# Altium project HeatSink.PrjPcb
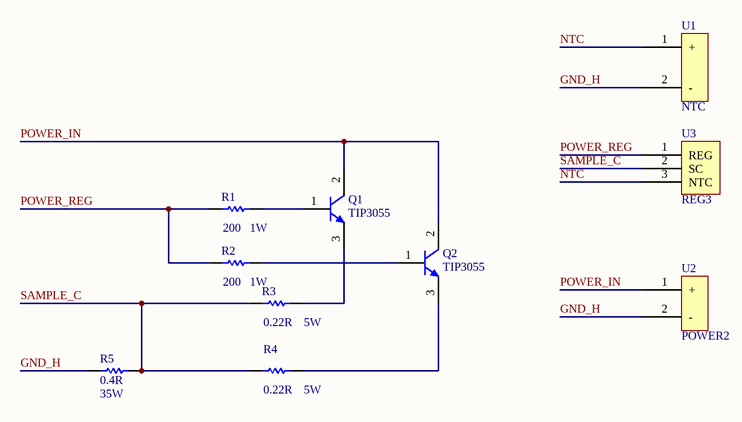
[diagram p0: HeatSink.SchDoc]
1 sheet, 10 parts. Net scope: global (net labels, ports and power ports of the same name join across sheets).
Board file: HeatSink.PcbDoc

## Sheet HeatSink.SchDoc
size A3; SheetNumber: 1; SheetTotal: 1

### Parts
Q1  TIP3055  [TO-247-ZUO]
Q2  TIP3055  [TO-247-ZUO]
R1  1W  value 200  [AXIAL-0.7]
R2  1W  value 200  [AXIAL-0.7]
R3  5W  value 0.22R  [AXIAL-0.4-BigHole]
R4  5W  value 0.22R  [AXIAL-0.4-BigHole]
R5  35W  value 0.4R  [TO-220AB - 2 Legs]
U1  NTC  [X254-2P]
U2  POWER2  [KF128-50-2P]
U3  REG3  [X254-3P]

### Nets
GND_H: R5.2 U1.2(-) U2.2(-)
NTC: U1.1(+) U3.3(NTC)
POWER_IN: Q1.2(C) Q2.2(C) U2.1(+)
POWER_REG: R1.2 R2.2 U3.1(REG)
SAMPLE_C: R3.2 R4.2 R5.1 U3.2(SC)
NetQ1_1: Q1.1(B) R1.1
NetQ1_3: Q1.3(E) R3.1
NetQ2_1: Q2.1(B) R2.1
NetQ2_3: Q2.3(E) R4.1

### Library data of the parts
Q1 Q2 = NPN: NPN Bipolar Transistor; Published: 8-Jun-2000; LatestRevisionDate: 17-Jul-2002; LatestRevisionNote: Re-released for DXP Platform.; PackageReference: TO-226-AA; Publisher: Altium Limited; PackageDescription: TO, Flat Index; 3 In-Line, Axial Leads; Body Dia. 4.8mm; Leads 0.55 x 0.51 mm (max); Code_JEDEC: TO-226-AA
R1-R5 = Res1: Resistor; Published: 8-Jun-2000; LatestRevisionDate: 17-Jul-2002; LatestRevisionNote: Re-released for DXP Platform.; PackageReference: AXIAL-0.3; Publisher: Altium Limited; PackageDescription: Axial Device, Thru-Hole; 2 Leads; 0.3 in Pin Spacing
U3 = REG3: REG2